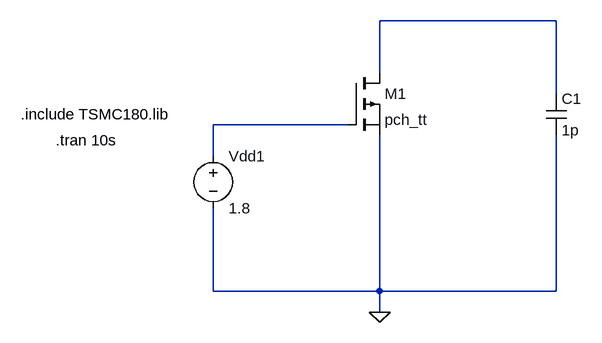
[diagram p0: schematic Q1p.asc]
Q1p.asc, the LTspice schematic file:
Version 4
SHEET 1 880 680
WIRE 672 -64 400 -64
WIRE 400 16 400 -64
WIRE 672 48 672 -64
WIRE 352 96 144 96
WIRE 144 144 144 96
WIRE 144 352 144 224
WIRE 400 352 400 112
WIRE 400 352 144 352
WIRE 672 352 672 112
WIRE 672 352 400 352
WIRE 400 384 400 352
FLAG 400 384 0
SYMBOL voltage 144 128 R0
SYMATTR InstName Vdd1
SYMATTR Value 1.8
SYMBOL cap 656 48 R0
SYMATTR InstName C1
SYMATTR Value 1p
SYMATTR SpiceLine IC=1.8
SYMBOL pmos 352 16 R0
SYMATTR InstName M1
SYMATTR Value pch_tt
SYMATTR Value2 w=240n l=180n
TEXT -152 80 Left 2 !.include TSMC180.lib
TEXT -98 120 Left 2 !.tran 10s

The netlist it stands for:
* Q1p.asc
Vdd1 N002 0 1.8
C1 N001 0 1p IC=1.8
M1 N001 N002 0 0 pch_tt w=240n l=180n
.model NMOS NMOS
.model PMOS PMOS
.lib standard.mos
.include TSMC180.lib
.tran 10s
.backanno
.end